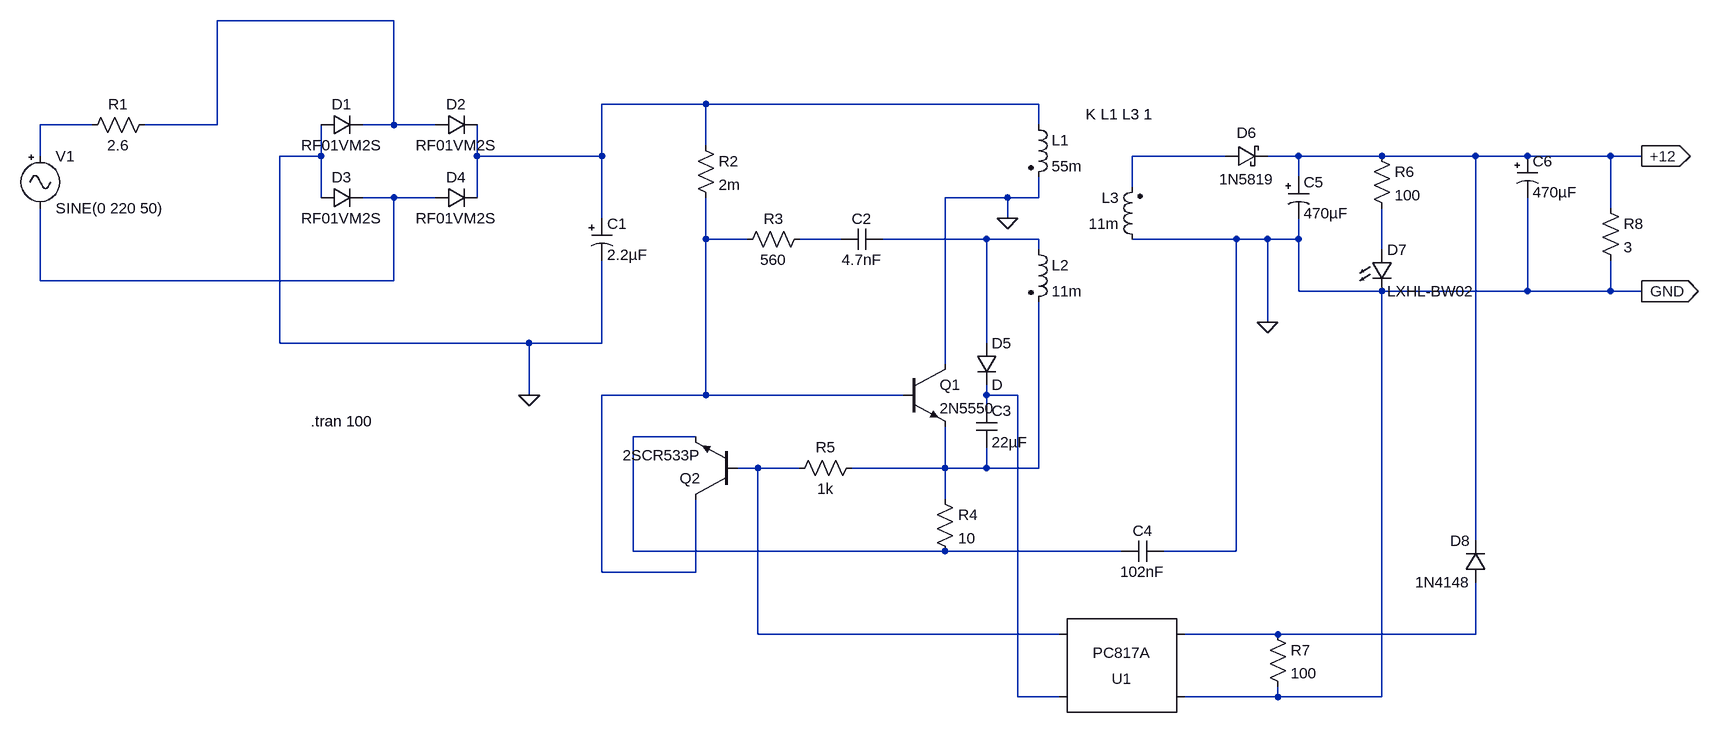
[diagram p0: schematic Out 6-7 V.asc]
Out 6-7 V.asc, the LTspice schematic file:
Version 4
SHEET 1 2628 984
WIRE 544 -128 272 -128
WIRE 1024 0 864 0
WIRE 1536 0 1024 0
WIRE 80 32 0 32
WIRE 272 32 272 -128
WIRE 272 32 160 32
WIRE 544 32 544 -128
WIRE 544 32 496 32
WIRE 608 32 544 32
WIRE 1536 32 1536 0
WIRE 1024 64 1024 0
WIRE 0 80 0 32
WIRE 432 80 432 32
WIRE 432 80 368 80
WIRE 672 80 672 32
WIRE 864 80 864 0
WIRE 864 80 672 80
WIRE 1824 80 1680 80
WIRE 1936 80 1888 80
WIRE 2064 80 1936 80
WIRE 2208 80 2064 80
WIRE 2288 80 2208 80
WIRE 2416 80 2288 80
WIRE 2464 80 2416 80
WIRE 1936 112 1936 80
WIRE 1680 128 1680 80
WIRE 432 144 432 80
WIRE 544 144 496 144
WIRE 608 144 544 144
WIRE 672 144 672 80
WIRE 1488 144 1392 144
WIRE 1536 144 1536 112
WIRE 1536 144 1488 144
WIRE 2416 160 2416 80
WIRE 864 176 864 80
WIRE 1488 176 1488 144
WIRE 1024 208 1024 144
WIRE 1088 208 1024 208
WIRE 1232 208 1168 208
WIRE 1456 208 1296 208
WIRE 1536 208 1456 208
WIRE 1840 208 1680 208
WIRE 1888 208 1840 208
WIRE 1936 208 1936 176
WIRE 1936 208 1888 208
WIRE 1536 224 1536 208
WIRE 2064 224 2064 160
WIRE 0 272 0 160
WIRE 544 272 544 144
WIRE 544 272 0 272
WIRE 1936 288 1936 208
WIRE 2064 288 1936 288
WIRE 2288 288 2288 144
WIRE 2288 288 2064 288
WIRE 2416 288 2416 240
WIRE 2416 288 2288 288
WIRE 2464 288 2416 288
WIRE 1888 336 1888 208
WIRE 368 368 368 80
WIRE 752 368 368 368
WIRE 864 368 864 240
WIRE 864 368 752 368
WIRE 1456 368 1456 208
WIRE 1392 400 1392 144
WIRE 752 448 752 368
WIRE 1024 448 1024 208
WIRE 1024 448 864 448
WIRE 1328 448 1024 448
WIRE 1456 448 1456 432
WIRE 1504 448 1456 448
WIRE 1456 464 1456 448
WIRE 1008 512 912 512
WIRE 1104 560 1072 560
WIRE 1168 560 1104 560
WIRE 1392 560 1392 496
WIRE 1392 560 1248 560
WIRE 1456 560 1456 528
WIRE 1456 560 1392 560
WIRE 1536 560 1536 304
WIRE 1536 560 1456 560
WIRE 1392 608 1392 560
WIRE 2208 672 2208 80
WIRE 912 688 912 512
WIRE 1392 688 912 688
WIRE 1664 688 1392 688
WIRE 1840 688 1840 208
WIRE 1840 688 1728 688
WIRE 864 720 864 448
WIRE 1008 720 1008 608
WIRE 1008 720 864 720
WIRE 1104 816 1104 560
WIRE 1568 816 1104 816
WIRE 1904 816 1760 816
WIRE 2208 816 2208 736
WIRE 2208 816 1904 816
WIRE 1504 912 1504 448
WIRE 1568 912 1504 912
WIRE 1904 912 1904 896
WIRE 1904 912 1760 912
WIRE 2064 912 2064 288
WIRE 2064 912 1904 912
FLAG 1888 336 0
FLAG 752 448 0
FLAG 1488 176 0
FLAG 2464 80 +12
IOPIN 2464 80 Out
FLAG 2464 288 GND
IOPIN 2464 288 Out
SYMBOL Misc\\signal 0 64 R0
WINDOW 123 0 0 Left 0
WINDOW 39 0 0 Left 0
SYMATTR InstName V1
SYMATTR Value SINE(0 220 50)
SYMBOL res 176 16 R90
WINDOW 0 0 56 VBottom 2
WINDOW 3 32 56 VTop 2
SYMATTR InstName R1
SYMATTR Value 2.6
SYMBOL diode 432 48 R270
WINDOW 0 32 32 VTop 2
WINDOW 3 0 32 VBottom 2
SYMATTR InstName D1
SYMATTR Value RF01VM2S
SYMBOL diode 608 48 R270
WINDOW 0 32 32 VTop 2
WINDOW 3 0 32 VBottom 2
SYMATTR InstName D2
SYMATTR Value RF01VM2S
SYMBOL diode 432 160 R270
WINDOW 0 32 32 VTop 2
WINDOW 3 0 32 VBottom 2
SYMATTR InstName D3
SYMATTR Value RF01VM2S
SYMBOL diode 608 160 R270
WINDOW 0 32 32 VTop 2
WINDOW 3 0 32 VBottom 2
SYMATTR InstName D4
SYMATTR Value RF01VM2S
SYMBOL polcap 848 176 R0
SYMATTR InstName C1
SYMATTR Value 2.2µF
SYMATTR SpiceLine V=450
SYMBOL res 1008 48 R0
SYMATTR InstName R2
SYMATTR Value 2m
SYMBOL res 1184 192 R90
WINDOW 0 0 56 VBottom 2
WINDOW 3 32 56 VTop 2
SYMATTR InstName R3
SYMATTR Value 560
SYMBOL cap 1296 192 R90
WINDOW 0 0 32 VBottom 2
WINDOW 3 32 32 VTop 2
SYMATTR InstName C2
SYMATTR Value 4.7nF
SYMBOL ind2 1520 16 R0
SYMATTR InstName L1
SYMATTR Value 55m
SYMATTR Type ind
SYMBOL ind2 1520 208 R0
SYMATTR InstName L2
SYMATTR Value 11m
SYMATTR Type ind
SYMBOL npn 1328 400 R0
SYMATTR InstName Q1
SYMATTR Value 2N5550
SYMBOL res 1376 592 R0
SYMATTR InstName R4
SYMATTR Value 10
SYMBOL res 1264 544 R90
WINDOW 0 0 56 VBottom 2
WINDOW 3 32 56 VTop 2
SYMATTR InstName R5
SYMATTR Value 1k
SYMBOL npn 1072 608 R180
SYMATTR InstName Q2
SYMATTR Value 2SCR533P
SYMBOL diode 1440 368 R0
SYMATTR InstName D5
SYMBOL cap 1440 464 R0
SYMATTR InstName C3
SYMATTR Value 22µF
SYMATTR SpiceLine V=50
SYMBOL cap 1728 672 R90
WINDOW 0 0 32 VBottom 2
WINDOW 3 32 32 VTop 2
SYMATTR InstName C4
SYMATTR Value 102nF
SYMBOL ind2 1696 224 R180
WINDOW 0 36 80 Left 2
WINDOW 3 36 40 Left 2
SYMATTR InstName L3
SYMATTR Value 11m
SYMATTR Type ind
SYMBOL schottky 1824 96 R270
WINDOW 0 36 32 VTop 2
WINDOW 3 -4 32 VBottom 2
SYMATTR InstName D6
SYMATTR Value 1N5819
SYMATTR Description Zener Diode
SYMATTR Type zener
SYMBOL Optos\\PC817A 1664 864 R180
SYMATTR InstName U1
SYMBOL polcap 1920 112 R0
SYMATTR InstName C5
SYMATTR Value 470µF
SYMATTR SpiceLine V=25
SYMBOL res 2048 64 R0
SYMATTR InstName R6
SYMATTR Value 100
SYMBOL LED 2048 224 R0
SYMATTR InstName D7
SYMATTR Value LXHL-BW02
SYMBOL diode 2224 736 R180
WINDOW 0 24 64 Left 2
WINDOW 3 24 0 Left 2
SYMATTR InstName D8
SYMATTR Value 1N4148
SYMATTR Description Zener Diode
SYMATTR Type zener
SYMBOL res 1888 800 R0
SYMATTR InstName R7
SYMATTR Value 100
SYMBOL polcap 2272 80 R0
SYMATTR InstName C6
SYMATTR Value 470µF
SYMBOL res 2400 144 R0
SYMATTR InstName R8
SYMATTR Value 3
TEXT 416 488 Left 2 !.tran 100
TEXT 1608 16 Left 2 !K L1 L3 1

The netlist it stands for:
* Out 6-7 V.asc
V1 N003 N005 SINE(0 220 50)
R1 N001 N003 2.6
D1 0 N001 RF01VM2S
D2 N001 N002 RF01VM2S
D3 0 N005 RF01VM2S
D4 N005 N002 RF01VM2S
C1 N002 0 2.2µF V=450
R2 N002 N006 2m
R3 N007 N006 560
C2 N008 N007 4.7nF
L1 N002 0 55m
L2 N008 N013 11m
Q1 0 N006 N013 0 2N5550
R4 N013 N011 10
R5 N013 N012 1k
Q2 N006 N012 N011 0 2SCR533P
D5 N008 N010 D
C3 N010 N013 22µF V=50
C4 0 N011 102nF
L3 0 N004 11m
D6 N004 +12 1N5819
XU1 0 N014 N010 N012 PC817 Igain=1m
C5 +12 0 470µF V=25
R6 +12 N009 100
D7 N009 0 LXHL-BW02
D8 N014 +12 1N4148
R7 N014 0 100
C6 +12 0 470µF
R8 +12 0 3
.model D D
.lib standard.dio
.model NPN NPN
.model PNP PNP
.lib standard.bjt
.tran 100
K L1 L3 1
.lib PC817.sub
.backanno
.end